# Altium schematic sheet DDR3_Memory.SchDoc
size A3; SheetNumber: 4; SheetTotal: 5
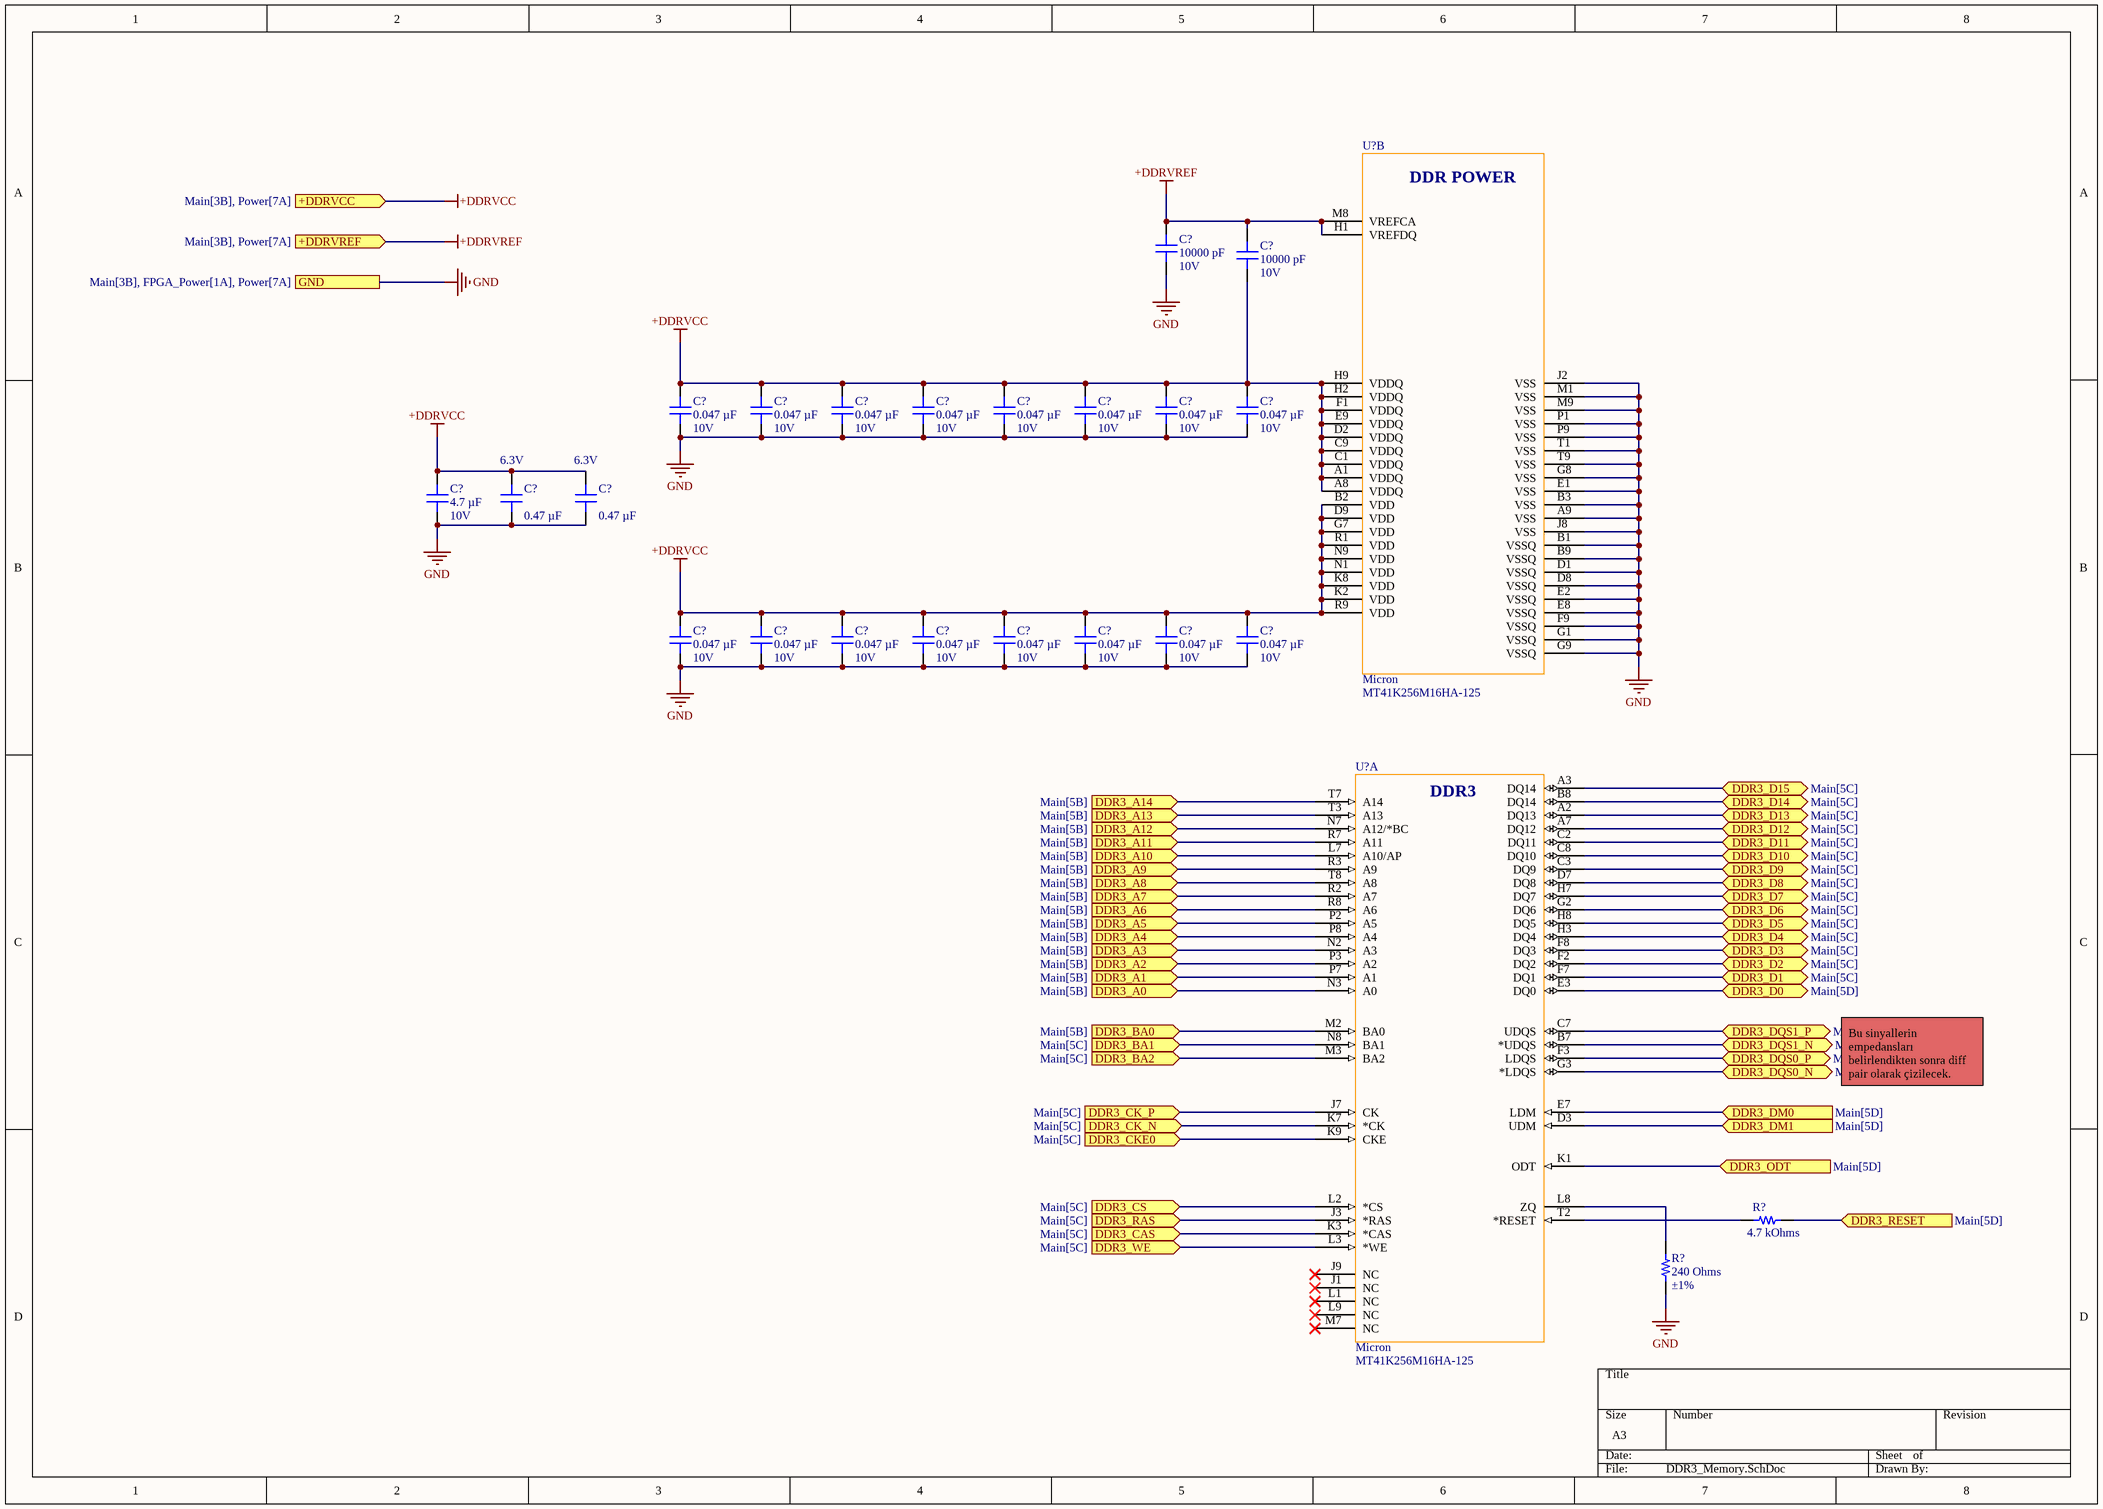
[diagram p0: DDR3_Memory.SchDoc]

## Parts
(Parts that share a designator on the sheet are numbered #1, #2 ... from top to bottom, then left to right.)
C?#1  Voltage - Rated: 10V  [CAP 0201_0603]  (hidden comment: 10000 pF)
C?#2  Voltage - Rated: 10V  [CAP 0201_0603]  (hidden comment: 10000 pF)
C?#3  Voltage - Rated: 10V  [CAP 0201_0603]  (hidden comment: 0.047 µF)
C?#4  Voltage - Rated: 10V  [CAP 0201_0603]  (hidden comment: 0.047 µF)
C?#5  Voltage - Rated: 10V  [CAP 0201_0603]  (hidden comment: 0.047 µF)
C?#6  Voltage - Rated: 10V  [CAP 0201_0603]  (hidden comment: 0.047 µF)
C?#7  Voltage - Rated: 10V  [CAP 0201_0603]  (hidden comment: 0.047 µF)
C?#8  Voltage - Rated: 10V  [CAP 0201_0603]  (hidden comment: 0.047 µF)
C?#9  Voltage - Rated: 10V  [CAP 0201_0603]  (hidden comment: 0.047 µF)
C?#10  Voltage - Rated: 10V  [CAP 0201_0603]  (hidden comment: 0.047 µF)
C?#11  Voltage - Rated: 10V  [CAP 0402_1005]  (hidden comment: 4.7 µF)
C?#12  Voltage - Rated: 6.3V  [CAP 0201_0603]  (hidden comment: 0.47 µF)
C?#13  Voltage - Rated: 6.3V  [CAP 0201_0603]  (hidden comment: 0.47 µF)
C?#14  Voltage - Rated: 10V  [CAP 0201_0603]  (hidden comment: 0.047 µF)
C?#15  Voltage - Rated: 10V  [CAP 0201_0603]  (hidden comment: 0.047 µF)
C?#16  Voltage - Rated: 10V  [CAP 0201_0603]  (hidden comment: 0.047 µF)
C?#17  Voltage - Rated: 10V  [CAP 0201_0603]  (hidden comment: 0.047 µF)
C?#18  Voltage - Rated: 10V  [CAP 0201_0603]  (hidden comment: 0.047 µF)
C?#19  Voltage - Rated: 10V  [CAP 0201_0603]  (hidden comment: 0.047 µF)
C?#20  Voltage - Rated: 10V  [CAP 0201_0603]  (hidden comment: 0.047 µF)
C?#21  Voltage - Rated: 10V  [CAP 0201_0603]  (hidden comment: 0.047 µF)
R?#1  4.7 kOhms  [RES 0201_0603]
R?#2  Tolerance: ±1%  [RES 0201_0603]  (hidden comment: 240 Ohms)
U?#1  Manufacturer: Micron  (hidden comment: MT41K256M16HA-125)  (part B of 2)
U?#2  Manufacturer: Micron  (hidden comment: MT41K256M16HA-125)  (part A of 2)

## Ports
+DDRVCC (in, see Main[3B], Power[7A]), +DDRVREF (in, see Main[3B], Power[7A]), DDR3_A0 (in, see Main[5B]), DDR3_A1 (in, see Main[5B]), DDR3_A2 (in, see Main[5B]), DDR3_A3 (in, see Main[5B]), DDR3_A4 (in, see Main[5B]), DDR3_A5 (in, see Main[5B]), DDR3_A6 (in, see Main[5B]), DDR3_A7 (in, see Main[5B]), DDR3_A8 (in, see Main[5B]), DDR3_A9 (in, see Main[5B]), DDR3_A10 (in, see Main[5B]), DDR3_A11 (in, see Main[5B]), DDR3_A12 (in, see Main[5B]), DDR3_A13 (in, see Main[5B]), DDR3_A14 (in, see Main[5B]), DDR3_BA0 (in, see Main[5B]), DDR3_BA1 (in, see Main[5C]), DDR3_BA2 (in, see Main[5C]), DDR3_CAS (in, see Main[5C]), DDR3_CK_N (in, see Main[5C]), DDR3_CK_P (in, see Main[5C]), DDR3_CKE0 (in, see Main[5C]), DDR3_CS (in, see Main[5C]), DDR3_D0 (bidir, see Main[5D]), DDR3_D1 (bidir, see Main[5C]), DDR3_D2 (bidir, see Main[5C]), DDR3_D3 (bidir, see Main[5C]), DDR3_D4 (bidir, see Main[5C]), DDR3_D5 (bidir, see Main[5C]), DDR3_D6 (bidir, see Main[5C]), DDR3_D7 (bidir, see Main[5C]), DDR3_D8 (bidir, see Main[5C]), DDR3_D9 (bidir, see Main[5C]), DDR3_D10 (bidir, see Main[5C]), DDR3_D11 (bidir, see Main[5C]), DDR3_D12 (bidir, see Main[5C]), DDR3_D13 (bidir, see Main[5C]), DDR3_D14 (bidir, see Main[5C]), DDR3_D15 (bidir, see Main[5C]), DDR3_DM0 (in, see Main[5D]), DDR3_DM1 (in, see Main[5D]), DDR3_DQS0_N (bidir, see Main[5D]), DDR3_DQS0_P (bidir, see Main[5D]), DDR3_DQS1_N (bidir, see Main[5D]), DDR3_DQS1_P (bidir, see Main[5D]), DDR3_ODT (in, see Main[5D]), DDR3_RAS (in, see Main[5C]), DDR3_RESET (in, see Main[5D]), DDR3_WE (in, see Main[5C]), GND (see Main[3B], FPGA_Power[1A], Power[7A])

## Nets
+DDRVCC: C?#2.1 C?#3.2 C?#4.2 C?#5.2 C?#6.2 C?#7.2 C?#8.2 C?#9.2 C?#10.2 C?#11.2 C?#12.2 C?#13.2 C?#14.2 C?#15.2 C?#16.2 C?#17.2 C?#18.2 C?#19.2 C?#20.2 C?#21.2 U?#1.A1(VDDQ) U?#1.A8(VDDQ) U?#1.B2(VDD) U?#1.C1(VDDQ) U?#1.C9(VDDQ) U?#1.D2(VDDQ) U?#1.D9(VDD) U?#1.E9(VDDQ) U?#1.F1(VDDQ) U?#1.G7(VDD) U?#1.H2(VDDQ) U?#1.H9(VDDQ) U?#1.K2(VDD) U?#1.K8(VDD) U?#1.N1(VDD) U?#1.N9(VDD) U?#1.R1(VDD) U?#1.R9(VDD) ; port +DDRVCC
+DDRVREF: C?#1.2 C?#2.2 U?#1.H1(VREFDQ) U?#1.M8(VREFCA) ; port +DDRVREF
GND: C?#1.1 C?#3.1 C?#4.1 C?#5.1 C?#6.1 C?#7.1 C?#8.1 C?#9.1 C?#10.1 C?#11.1 C?#12.1 C?#13.1 C?#14.1 C?#15.1 C?#16.1 C?#17.1 C?#18.1 C?#19.1 C?#20.1 C?#21.1 R?#2.1 U?#1.A9(VSS) U?#1.B1(VSSQ) U?#1.B3(VSS) U?#1.B9(VSSQ) U?#1.D1(VSSQ) U?#1.D8(VSSQ) U?#1.E1(VSS) U?#1.E2(VSSQ) U?#1.E8(VSSQ) U?#1.F9(VSSQ) U?#1.G1(VSSQ) U?#1.G8(VSS) U?#1.G9(VSSQ) U?#1.J2(VSS) U?#1.J8(VSS) U?#1.M1(VSS) U?#1.M9(VSS) U?#1.P1(VSS) U?#1.P9(VSS) U?#1.T1(VSS) U?#1.T9(VSS) ; port GND
DDR3_A0: U?#2.N3(A0) ; port DDR3_A0
DDR3_A1: U?#2.P7(A1) ; port DDR3_A1
DDR3_A2: U?#2.P3(A2) ; port DDR3_A2
DDR3_A3: U?#2.N2(A3) ; port DDR3_A3
DDR3_A4: U?#2.P8(A4) ; port DDR3_A4
DDR3_A5: U?#2.P2(A5) ; port DDR3_A5
DDR3_A6: U?#2.R8(A6) ; port DDR3_A6
DDR3_A7: U?#2.R2(A7) ; port DDR3_A7
DDR3_A8: U?#2.T8(A8) ; port DDR3_A8
DDR3_A9: U?#2.R3(A9) ; port DDR3_A9
DDR3_A10: U?#2.L7(A10/AP) ; port DDR3_A10
DDR3_A11: U?#2.R7(A11) ; port DDR3_A11
DDR3_A12: U?#2.N7(A12/*BC) ; port DDR3_A12
DDR3_A13: U?#2.T3(A13) ; port DDR3_A13
DDR3_A14: U?#2.T7(A14) ; port DDR3_A14
DDR3_BA0: U?#2.M2(BA0) ; port DDR3_BA0
DDR3_BA1: U?#2.N8(BA1) ; port DDR3_BA1
DDR3_BA2: U?#2.M3(BA2) ; port DDR3_BA2
DDR3_CAS: U?#2.K3(*CAS) ; port DDR3_CAS
DDR3_CK_N: U?#2.K7(*CK) ; port DDR3_CK_N
DDR3_CK_P: U?#2.J7(CK) ; port DDR3_CK_P
DDR3_CKE0: U?#2.K9(CKE) ; port DDR3_CKE0
DDR3_CS: U?#2.L2(*CS) ; port DDR3_CS
DDR3_D0: U?#2.E3(DQ0) ; port DDR3_D0
DDR3_D1: U?#2.F7(DQ1) ; port DDR3_D1
DDR3_D2: U?#2.F2(DQ2) ; port DDR3_D2
DDR3_D3: U?#2.F8(DQ3) ; port DDR3_D3
DDR3_D4: U?#2.H3(DQ4) ; port DDR3_D4
DDR3_D5: U?#2.H8(DQ5) ; port DDR3_D5
DDR3_D6: U?#2.G2(DQ6) ; port DDR3_D6
DDR3_D7: U?#2.H7(DQ7) ; port DDR3_D7
DDR3_D8: U?#2.D7(DQ8) ; port DDR3_D8
DDR3_D9: U?#2.C3(DQ9) ; port DDR3_D9
DDR3_D10: U?#2.C8(DQ10) ; port DDR3_D10
DDR3_D11: U?#2.C2(DQ11) ; port DDR3_D11
DDR3_D12: U?#2.A7(DQ12) ; port DDR3_D12
DDR3_D13: U?#2.A2(DQ13) ; port DDR3_D13
DDR3_D14: U?#2.B8(DQ14) ; port DDR3_D14
DDR3_D15: U?#2.A3(DQ14) ; port DDR3_D15
DDR3_DM0: U?#2.E7(LDM) ; port DDR3_DM0
DDR3_DM1: U?#2.D3(UDM) ; port DDR3_DM1
DDR3_DQS0_N: U?#2.G3(*LDQS) ; port DDR3_DQS0_N
DDR3_DQS0_P: U?#2.F3(LDQS) ; port DDR3_DQS0_P
DDR3_DQS1_N: U?#2.B7(*UDQS) ; port DDR3_DQS1_N
DDR3_DQS1_P: U?#2.C7(UDQS) ; port DDR3_DQS1_P
DDR3_ODT: U?#2.K1(ODT) ; port DDR3_ODT
DDR3_RAS: U?#2.J3(*RAS) ; port DDR3_RAS
DDR3_RESET: R?#1.2 ; port DDR3_RESET
DDR3_WE: U?#2.L3(*WE) ; port DDR3_WE
NetR?#1_1: R?#1.1 U?#2.T2(*RESET)
NetR?#2_2: R?#2.2 U?#2.L8(ZQ)

Not connected (* = marked no-connect by the designer): U?#2 J1(NC)* J9(NC)* L1(NC)* L9(NC)* M7(NC)*

## Notes on the sheet
- Bu sinyallerin empedansları belirlendikten sonra diff pair olarak çizilecek.
- (in symbol MT41K256M16HA-125, part A) DDR3
- (in symbol MT41K256M16HA-125, part B) DDR POWER

## Library data of the parts
C?#1 C?#2 = MAASL063SB7103MFCA01: CAP CER 0.01UF 10V X7R 0201; manufacturer: Taiyo Yuden; Tolerance: ±20%; Part Number: MAASL063SB7103MFCA01; Value: 10000 pF; Applications: Automotive; Capacitance: 10000 pF; componentlink1description: Datasheet; componentlink1url: https://media.digikey.com/pdf/Data%20Sheets/Taiyo%20Yuden%20PDFs%20URL%20links/MAASL063SB7103MFCA01_SS.pdf; componentlink2description: DigiKey Link; componentlink2url: https://www.digikey.com/en/products/detail/taiyo-yuden/MAASL063SB7103MFCA01/18109005; Device Package: 0201 (0603 Metric); Height - Seated (Max): 0.013" (0.33mm); lastupdated: 27.04.2023 19:00:59; Lifecycle Status: Active; Minimum Order: 1; Mounting Type: Surface Mount, MLCC; Operating Temperature: -55°C ~ 125°C; Package / Case: 0201 (0603 Metric); packaging: TapeAndReel; partid: 47946; Part Status: Active; price: 0.01; Ratings: AEC-Q200; series: MAAS; Size / Dimension: 0.024" L x 0.012" W (0.60mm x 0.30mm); Supplier 1: DigiKey; Supplier Part Number 1: 587-MAASL063SB7103MFCA01CT-ND; Temperature Coefficient: X7R; Thickness (Max): 0.013" (0.33mm)
C?#3-C?#10 C?#14-C?#21 = LMK063BJ473KP-F: CAP CER 0.047UF 10V X5R 0201; manufacturer: Taiyo Yuden; Tolerance: ±10%; Part Number: LMK063BJ473KP-F; Value: 0.047 µF; Applications: SMPS Filtering; Capacitance: 0.047 µF; componentlink1description: Datasheet; componentlink1url: https://ds.yuden.co.jp/TYCOMPAS/ut/detail?pn=LMK063BJ473KP-F  &u=M; componentlink2description: DigiKey Link; componentlink2url: https://www.digikey.com/en/products/detail/taiyo-yuden/LMK063BJ473KP-F/2002857; Device Package: 0201 (0603 Metric); lastupdated: 27.04.2023 19:01:19; Lifecycle Status: Active; Minimum Order: 1; Mounting Type: Surface Mount, MLCC; Operating Temperature: -55°C ~ 85°C; Package / Case: 0201 (0603 Metric); packaging: TapeAndReel; partid: 223; Part Status: Active; price: 0.01; series: M; Size / Dimension: 0.024" L x 0.012" W (0.60mm x 0.30mm); Supplier 1: DigiKey; Supplier Part Number 1: 587-2242-1-ND; Temperature Coefficient: X5R; Thickness (Max): 0.013" (0.33mm)
C?#11 = GMC04X5R475K10NT: CAP0402 X5R 4.7UF 10% 10V; manufacturer: Cal-Chip Electronics, Inc.; Part Number: GMC04X5R475K10NT; Value: 4.7 µF; Applications: General Purpose; Capacitance: 4.7 µF; componentlink1description: Datasheet; componentlink1url: https://88ce57.p3cdn1.secureserver.net/wp-content/uploads/2023/01/gmc_series-2.pdf; componentlink2description: DigiKey Link; componentlink2url: https://www.digikey.com/en/products/detail/cal-chip-electronics-inc/GMC04X5R475K10NT/18151135; Device Package: 0402 (1005 Metric); lastupdated: 26.04.2023 19:01:59; Lifecycle Status: Active; Minimum Order: 1; Mounting Type: Surface Mount, MLCC; Operating Temperature: -55°C ~ 85°C; Package / Case: 0402 (1005 Metric); packaging: TapeAndReel; partid: 49814; Part Status: Active; price: 0.01; series: GMC; Size / Dimension: 0.039" L x 0.020" W (1.00mm x 0.50mm); Supplier 1: DigiKey; Supplier Part Number 1: 4713-GMC04X5R475K10NTCT-ND; Temperature Coefficient: X5R; Thickness (Max): 0.028" (0.70mm); Tolerance: ±10%
C?#12 C?#13 = JMK063BC6474KP-F: CAP CER 0.47UF 6.3V X6S 0201; manufacturer: Taiyo Yuden; Tolerance: ±10%; Part Number: JMK063BC6474KP-F; Value: 0.47 µF; Applications: SMPS Filtering; Capacitance: 0.47 µF; componentlink1description: Datasheet; componentlink1url: https://ds.yuden.co.jp/TYCOMPAS/ut/detail?pn=JMK063BC6474KP-F&u=M; componentlink2description: DigiKey Link; componentlink2url: https://www.digikey.com/en/products/detail/taiyo-yuden/JMK063BC6474KP-F/9947925; Device Package: 0201 (0603 Metric); lastupdated: 26.04.2023 19:00:46; Lifecycle Status: Active; Minimum Order: 1; Mounting Type: Surface Mount, MLCC; Operating Temperature: -55°C ~ 105°C; Package / Case: 0201 (0603 Metric); packaging: TapeAndReel; partid: 108; Part Status: Active; price: 0.01; series: M; Size / Dimension: 0.024" L x 0.012" W (0.60mm x 0.30mm); Supplier 1: DigiKey; Supplier Part Number 1: 587-6386-1-ND; Temperature Coefficient: X6S; Thickness (Max): 0.015" (0.39mm)
R?#1 = CRCW02014K70FKED: RES SMD 4.7K OHM 1% 1/20W 0201; Manufacturer: Vishay Dale; Power (Watts): 0.05W, 1/20W; Temperature Coefficient: ±100ppm/°C; Part Number: CRCW02014K70FKED; Value: 4.7 kOhms; ComponentLink1Description: Datasheet; ComponentLink1URL: http://www.vishay.com/docs/20052/crcw0201e3.pdf; ComponentLink2Description: DigiKey Link; ComponentLink2URL: https://www.digikey.com/en/products/detail/vishay-dale/CRCW02014K70FKED/1968069; Composition: Thick Film; Device Package: 0201 (0603 Metric); Height - Seated (Max): 0.010" (0.26mm); LastUpdated: 27.04.2023 19:19:02; Lifecycle Status: Active; Minimum Order: 1; Number of Terminations: 2; Operating Temperature: -55°C ~ 155°C; Package / Case: 0201 (0603 Metric); Packaging: TapeAndReel; PartId: 37; Part Status: Active; Price: 0.03; Resistance: 4.7 kOhms; Series: CRCW; Size / Dimension: 0.024" L x 0.012" W (0.60mm x 0.30mm); Supplier 1: DigiKey; Supplier Part Number 1: 541-4.70KAABCT-ND; Supplier Device Package: 0201; Tolerance: ±1%
R?#2 = ERJ-U01F2400C: RES SMD 240 OHM 1% 1/20W 0201; Manufacturer: Panasonic Electronic Components; Power (Watts): 0.05W, 1/20W; Temperature Coefficient: ±200ppm/°C; Part Number: ERJ-U01F2400C; Value: 240 Ohms; ComponentLink1Description: Datasheet; ComponentLink1URL: http://industrial.panasonic.com/www-cgi/jvcr13pz.cgi?E+PZ+3+AOA0001+ERJU01F2400C+8+WW; ComponentLink2Description: DigiKey Link; ComponentLink2URL: https://www.digikey.com/en/products/detail/panasonic-electronic-components/ERJ-U01F2400C/3982785; Composition: Thick Film; Device Package: 0201 (0603 Metric); Features: Anti-Sulfur; Height - Seated (Max): 0.010" (0.26mm); LastUpdated: 27.04.2023 19:19:01; Lifecycle Status: Active; Minimum Order: 1; Number of Terminations: 2; Operating Temperature: -55°C ~ 125°C; Package / Case: 0201 (0603 Metric); Packaging: TapeAndReel; PartId: 96; Part Status: Active; Price: 0.04; Resistance: 240 Ohms; Series: ERJ-U01; Size / Dimension: 0.024" L x 0.012" W (0.60mm x 0.30mm); Supplier 1: DigiKey; Supplier Part Number 1: P16143CT-ND; Supplier Device Package: 0201
U?#1 U?#2 = MT41K256M16HA-125: Manufacturer Part Number: MT41K256M16HA-125